# EAGLE design 16n (EAGLE 7.6.0)
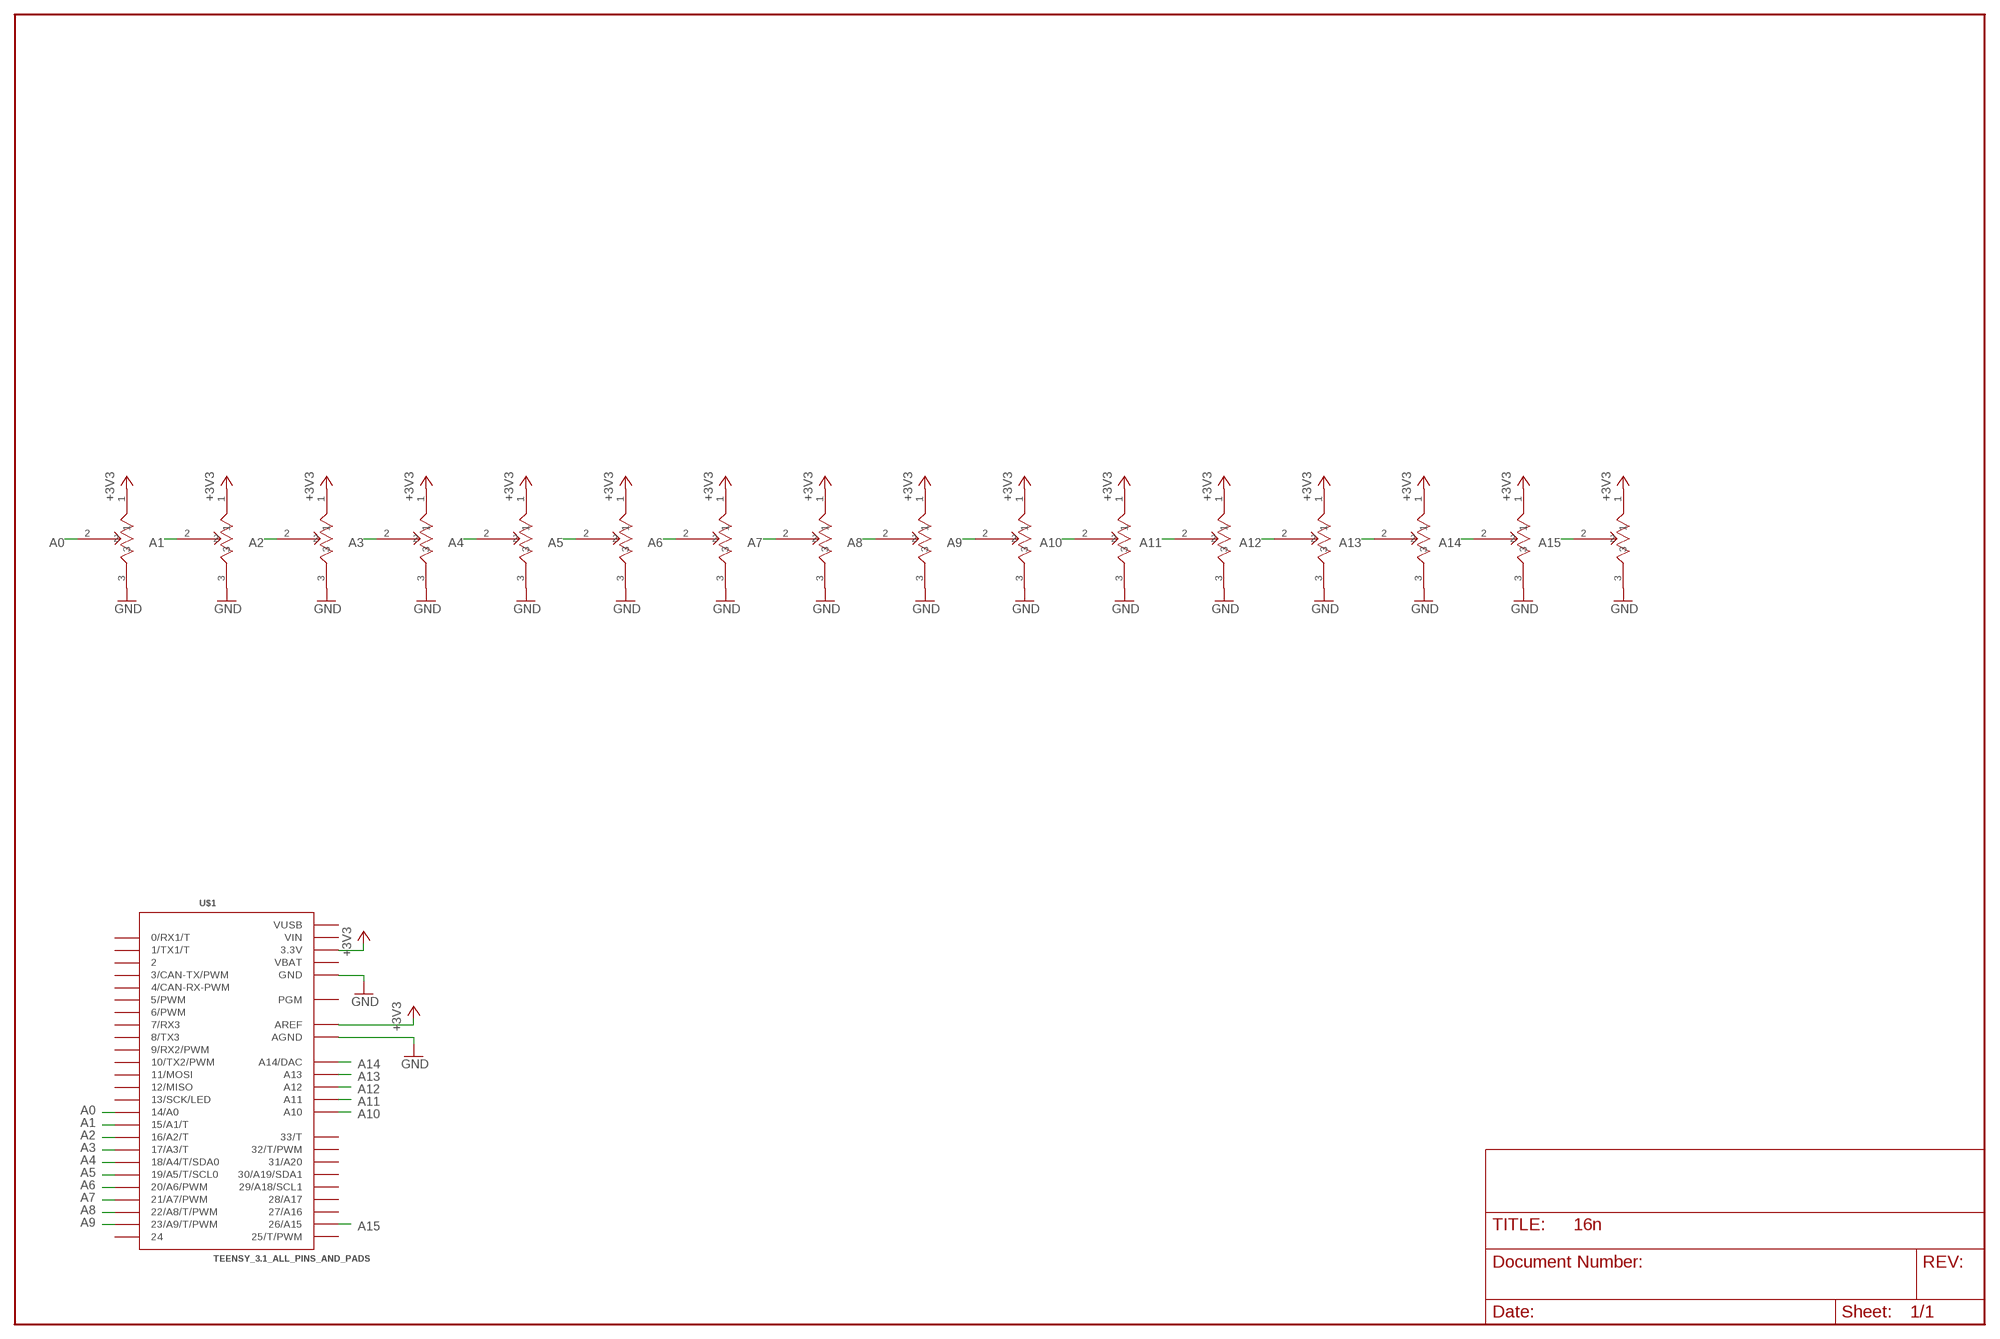
[diagram p0: schematic, sheet 1]

## Parts
U$1  TEENSY_3.1_ALL_PINS_AND_PADS  [TEENSY_3.1_ALLPINS]
U$2  SLIDEPOT-ALPS-60MM  [RS6011SP600]
U$3  SLIDEPOT-ALPS-60MM  [RS6011SP600]
U$4  SLIDEPOT-ALPS-60MM  [RS6011SP600]
U$5  SLIDEPOT-ALPS-60MM  [RS6011SP600]
U$6  SLIDEPOT-ALPS-60MM  [RS6011SP600]
U$7  SLIDEPOT-ALPS-60MM  [RS6011SP600]
U$8  SLIDEPOT-ALPS-60MM  [RS6011SP600]
U$9  SLIDEPOT-ALPS-60MM  [RS6011SP600]
U$10  SLIDEPOT-ALPS-60MM  [RS6011SP600]
U$11  SLIDEPOT-ALPS-60MM  [RS6011SP600]
U$12  SLIDEPOT-ALPS-60MM  [RS6011SP600]
U$13  SLIDEPOT-ALPS-60MM  [RS6011SP600]
U$14  SLIDEPOT-ALPS-60MM  [RS6011SP600]
U$15  SLIDEPOT-ALPS-60MM  [RS6011SP600]
U$16  SLIDEPOT-ALPS-60MM  [RS6011SP600]
U$17  SLIDEPOT-ALPS-60MM  [RS6011SP600]

## Nets
+3V3: U$1.3.3V U$1.3.3V1(3.3V) U$1.3.3V2(3.3V) U$1.AREF U$2.1 U$3.1 U$4.1 U$5.1 U$6.1 U$7.1 U$8.1 U$9.1 U$10.1 U$11.1 U$12.1 U$13.1 U$14.1 U$15.1 U$16.1 U$17.1
A0: U$1.14/A0 U$2.2
A1: U$1.15/A1(15/A1/T) U$3.2
A2: U$1.16/A2(16/A2/T) U$4.2
A3: U$1.17/A3(17/A3/T) U$5.2
A4: U$1.18/A4(18/A4/T/SDA0) U$6.2
A5: U$1.19/A5(19/A5/T/SCL0) U$7.2
A6: U$1.20/A6(20/A6/PWM) U$8.2
A7: U$1.21/A7(21/A7/PWM) U$9.2
A8: U$1.22/A8(22/A8/T/PWM) U$10.2
A9: U$1.23/A9(23/A9/T/PWM) U$11.2
A10: U$1.A10 U$12.2
A11: U$1.A11 U$13.2
A12: U$1.A12 U$14.2
A13: U$1.A13 U$15.2
A14: U$1.A14(A14/DAC) U$16.2
A15: U$1.26(26/A15) U$17.2
GND: U$1.AGND U$1.GND U$1.GND1(GND) U$1.GND2(GND) U$2.3 U$3.3 U$4.3 U$5.3 U$6.3 U$7.3 U$8.3 U$9.3 U$10.3 U$11.3 U$12.3 U$13.3 U$14.3 U$15.3 U$16.3 U$17.3
Unconnected: U$1.0(0/RX1/T) U$1.1(1/TX1/T) U$1.2 U$1.3(3/CAN-TX/PWM) U$1.4(4/CAN-RX-PWM) U$1.5(5/PWM) U$1.6(6/PWM) U$1.7(7/RX3) U$1.8(8/TX3) U$1.9(9/RX2/PWM) U$1.10(10/TX2/PWM) U$1.11(11/MOSI) U$1.12(12/MISO) U$1.13(13/SCK/LED) U$1.24 U$1.25(25/T/PWM) U$1.27(27/A16) U$1.28(28/A17) U$1.29(29/A18/SCL1) U$1.30(30/A19/SDA1) U$1.31(31/A20) U$1.32(32/T/PWM) U$1.33(33/T) U$1.PGM

## Power pins joined to a net without a drawn wire
VBAT: U$1.VBAT
VIN: U$1.VIN
VUSB: U$1.VUSB

## Library data of the parts
U$1 = Teensy_3_Series_Board_v1.0:TEENSY_3.1_ALL_PINS_AND_PADS: Footprint for Teensy 3.1 board using all pads and all through-holes. Pads need a 2x7 0.1" SMD header.
U$2-U$17 = monome:SLIDEPOT-ALPS-60MM

## Board
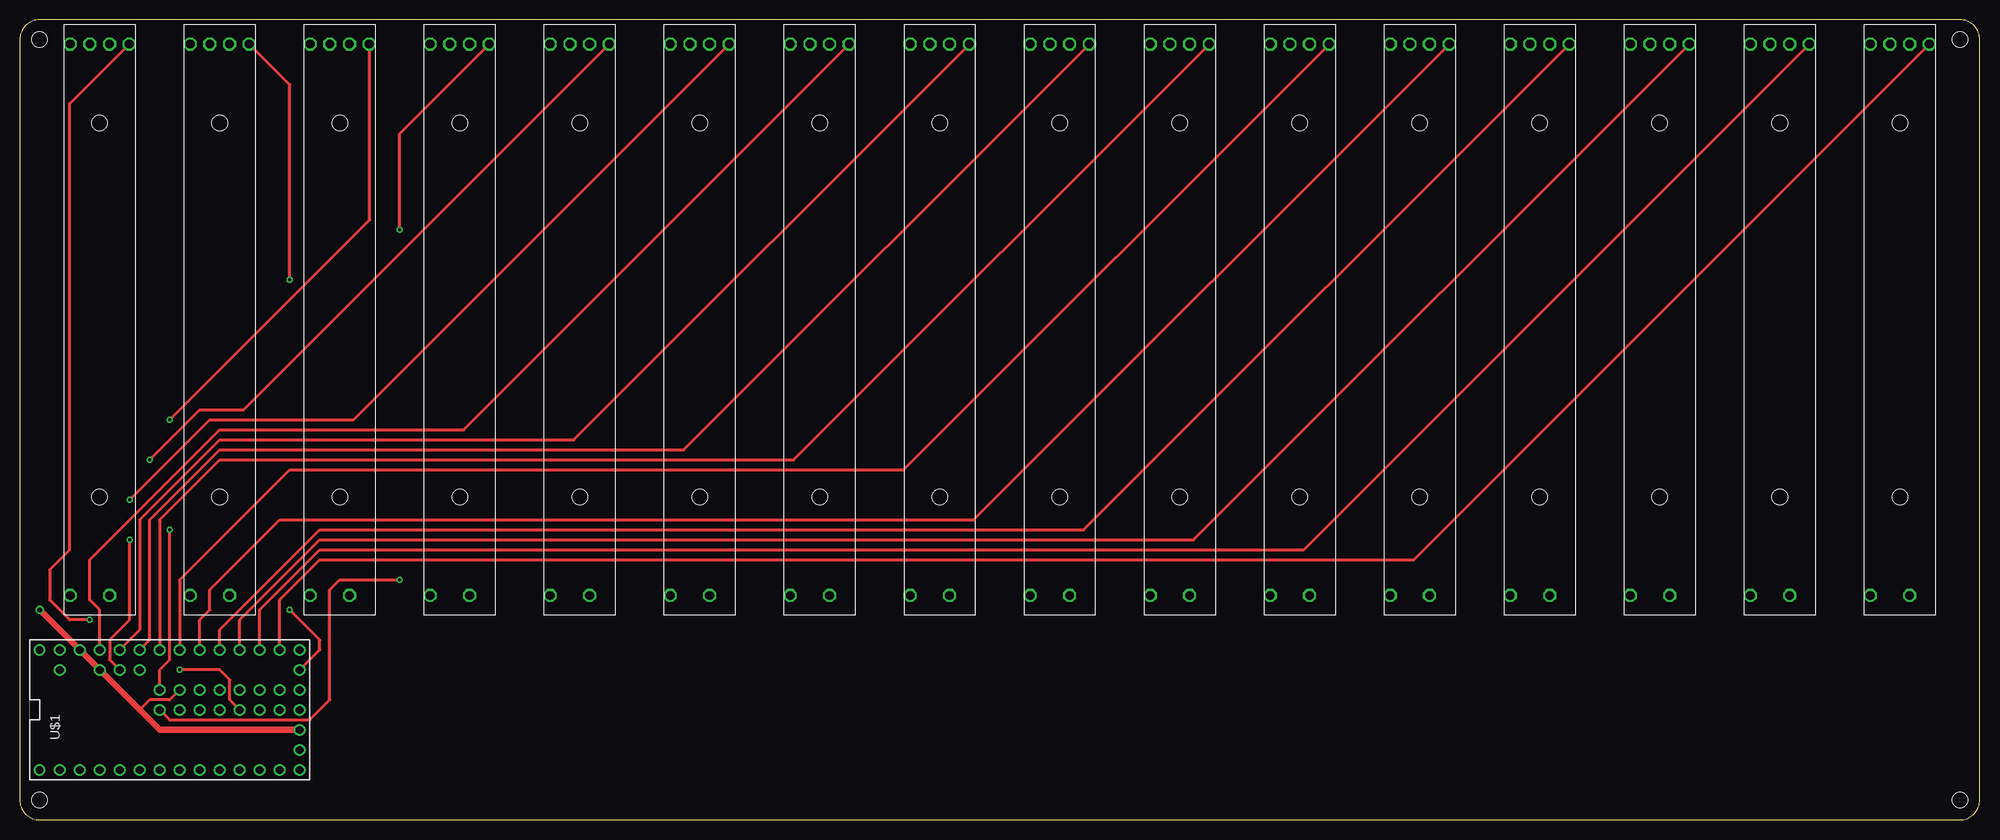
[diagram p1: board, top side]
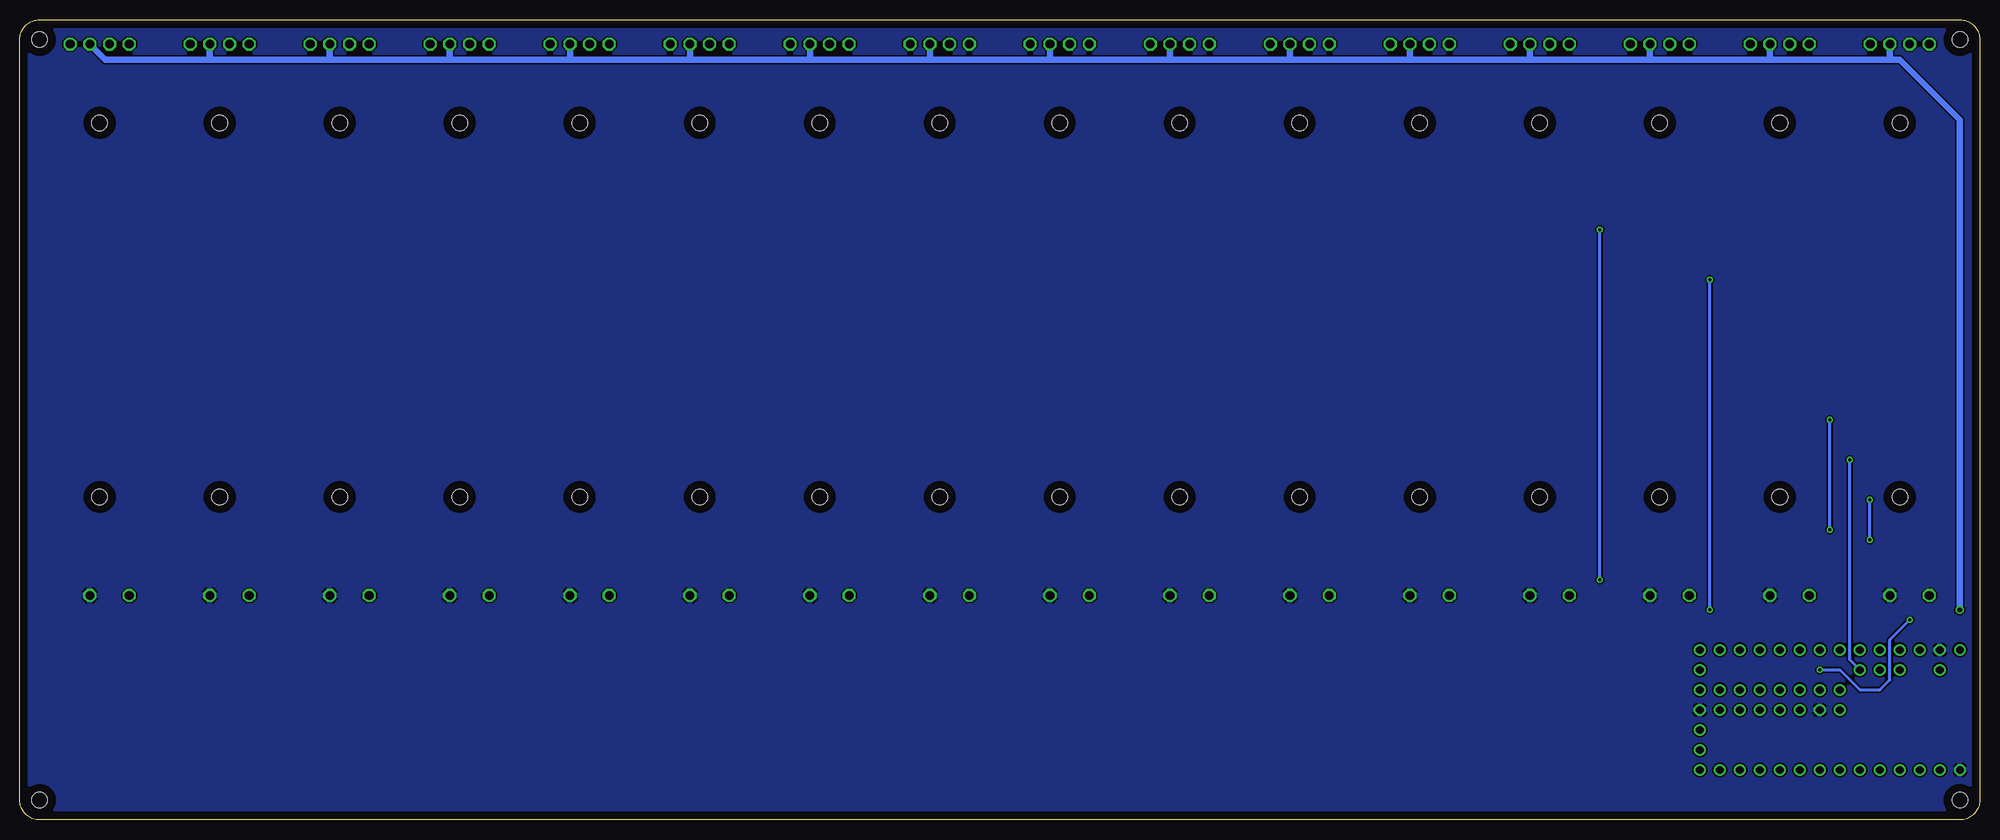
[diagram p2: board, bottom side, seen from below]

Size 248.92 x 101.6 mm. Coordinates in mm from the lower left corner, seen from the top.
Outline: 2.54,0 246.38,0 arc90 248.92,2.54 248.92,99.06 arc90 246.38,101.6 2.54,101.6 arc90 0,99.06 0,2.54 arc90 2.54,0
Copper layers (1*16): Top 0.035mm / dielectric 1.5mm / Bottom 0.035mm
Design rules "default": minimum track width 10mil, minimum drill 24mil, track to track 8mil, track to pad 8mil, pad to pad 8mil, via to via 8mil, smd to smd 8mil, copper to edge 40mil, drill to drill 8mil, minimum pad ring 10mil, minimum via ring 8mil, stop-mask expansion 4mil, vias tented up to drill 0mil, thermal gap 10mil
Holes 2 mm at 2.54,2.54 246.38,99.06 246.38,2.54 2.54,99.06

### Footprints (pad centres in the part's own frame; a part is rotated, then mirrored left to right if it is on the bottom)
TEENSY_3.1_ALLPINS = drill 0.965: 0 -7.62,15.24; 1 -7.62,12.7; 2 -7.62,10.16; 3 -7.62,7.62; 3.3V 7.62,12.7; 3.3V1 -2.54,-15.24; 3.3V2 2.54,0; 4 -7.62,5.08; 5 -7.62,2.54; 6 -7.62,0; 7 -7.62,-2.54; 8 -7.62,-5.08; 9 -7.62,-7.62; 10 -7.62,-10.16; 11 -7.62,-12.7; 12 -7.62,-15.24; 13 7.62,-15.24; 14/A0 7.62,-12.7; 15/A1 7.62,-10.16; 16/A2 7.62,-7.62; 17/A3 7.62,-5.08; 18/A4 7.62,-2.54; 19/A5 7.62,0; 20/A6 7.62,2.54; 21/A7 7.62,5.08; 22/A8 7.62,7.62; 23/A9 7.62,10.16; 24 0,-2.54; 25 0,-5.08; 26 0,-7.62; 27 0,-10.16; 28 0,-12.7; 29 2.54,-12.7; 30 2.54,-10.16; 31 2.54,-7.62; 32 2.54,-5.08; 33 2.54,-2.54; A10 5.08,7.62; A11 5.08,5.08; A12 0,2.54; A13 2.54,2.54; A14 5.08,-15.24; AGND 7.62,15.24; AREF 5.08,10.16; GND -7.62,17.78; GND1 0,-15.24; GND2 0,0; PGM 2.54,-15.24; VBAT -5.08,-15.24; VIN 7.62,17.78; VUSB 5.08,15.24
RS6011SP600 = drill 1.1 octagon: 1 -35,1.25; 2 -35,3.75; 3 35,1.25; L1 35,-3.75; L2 -35,-3.75; L3 -35,-1.25 | hole 2: -25,0; 22.5,0

### Placement (x,y rotation side)
U$1  20.32,13.97 90 top
U$2  238.76,63.5 270 top
U$3  223.52,63.5 270 top
U$4  208.28,63.5 270 top
U$5  193.04,63.5 270 top
U$6  177.8,63.5 270 top
U$7  162.56,63.5 270 top
U$8  147.32,63.5 270 top
U$9  132.08,63.5 270 top
U$10  116.84,63.5 270 top
U$11  101.6,63.5 270 top
U$12  86.36,63.5 270 top
U$13  71.12,63.5 270 top
U$14  55.88,63.5 270 top
U$15  40.64,63.5 270 top
U$16  25.4,63.5 270 top
U$17  10.16,63.5 270 top

### Tracks (layer width: path | path; a pad name or v marks a point on that pad's centre or on a via)
+3V3  (via drill 0.6)
  Top 0.406: U$1.3.3V2 19.05,15.24 16.51,15.24 15.24,13.97
  Top 0.813: v2.54,26.67 U$1.3.3V U$1.AREF 15.24,13.97 17.78,11.43 U$1.3.3V1
  Bottom 0.813: v2.54,26.67 2.54,88.9 10.16,96.52 11.43,96.52 | 11.43,96.52 26.67,96.52 | 26.67,96.52 41.91,96.52 | 41.91,96.52 57.15,96.52 | 57.15,96.52 72.39,96.52 | 72.39,96.52 87.63,96.52 | 87.63,96.52 102.87,96.52 | 102.87,96.52 118.11,96.52 | 118.11,96.52 133.35,96.52 | 133.35,96.52 148.59,96.52 | 148.59,96.52 163.83,96.52 | 163.83,96.52 179.07,96.52 | 179.07,96.52 194.31,96.52 | 194.31,96.52 209.55,96.52 | 209.55,96.52 224.79,96.52 | 224.79,96.52 238.03,96.52 U$2.1 | U$3.1 224.77,96.54 224.79,96.52 | U$4.1 209.53,96.54 209.55,96.52 | U$5.1 194.29,96.54 194.31,96.52 | U$6.1 179.05,96.54 179.07,96.52 | U$7.1 163.81,96.54 163.83,96.52 | U$8.1 148.57,96.54 148.59,96.52 | U$9.1 133.33,96.54 133.35,96.52 | U$10.1 118.09,96.54 118.11,96.52 | U$11.1 102.85,96.54 102.87,96.52 | U$12.1 87.61,96.54 87.63,96.52 | U$13.1 72.37,96.54 72.39,96.52 | U$14.1 57.13,96.54 57.15,96.52 | U$15.1 41.89,96.54 41.91,96.52 | U$16.1 26.65,96.54 26.67,96.52 | U$17.1 11.41,96.54 11.43,96.52
A0
  Top 0.406: U$2.2 177.03,33.02 38.1,33.02 33.02,27.94 U$1.14/A0
A1
  Top 0.406: U$3.2 163.06,34.29 38.1,34.29 30.48,26.67 U$1.15/A1
A2
  Top 0.406: U$4.2 149.09,35.56 38.1,35.56 27.94,25.4 U$1.16/A2
A3
  Top 0.406: U$5.2 135.12,36.83 38.1,36.83 25.4,24.13 U$1.17/A3
A4
  Top 0.406: U$6.2 121.15,38.1 33.02,38.1 24.13,29.21 24.13,26.67 22.86,25.4 U$1.18/A4
A5
  Top 0.406: U$7.2 112.26,44.45 34.29,44.45 20.32,30.48 U$1.19/A5
A6
  Top 0.406: U$8.2 98.29,45.72 25.4,45.72 17.78,38.1 U$1.20/A6
A7
  Top 0.406: U$9.2 84.32,46.99 25.4,46.99 16.51,38.1 16.51,22.86 U$1.21/A7
A8
  Top 0.406: U$10.2 70.35,48.26 25.4,48.26 15.24,38.1 15.24,24.13 U$1.22/A8
A9
  Top 0.406: U$11.2 56.38,49.53 25.4,49.53 8.89,33.02 8.89,27.94 10.16,26.67 U$1.23/A9
A10  (via drill 0.38)
  Top 0.406: v13.97,40.64 24.13,50.8 42.41,50.8 U$12.2 | v13.97,35.56 13.97,25.4 11.43,22.86 11.43,20.32 U$1.A10
  Bottom 0.406: v13.97,35.56 v13.97,40.64
A11  (via drill 0.38)
  Top 0.406: v16.51,45.72 22.86,52.07 28.44,52.07 U$13.2
  Bottom 0.406: U$1.A11 16.51,20.32 v16.51,45.72
A12  (via drill 0.38)
  Top 0.406: v48.26,30.48 40.64,30.48 39.37,29.21 39.37,15.24 36.83,12.7 19.05,12.7 U$1.A12 | v48.26,74.93 48.26,87.13 U$14.2
  Bottom 0.406: v48.26,30.48 v48.26,74.93
A13  (via drill 0.38)
  Top 0.406: v19.05,50.8 44.45,76.2 44.45,98.44 U$15.2 | U$1.A13 17.78,19.05 19.05,20.32 v19.05,36.83
  Bottom 0.406: v19.05,36.83 v19.05,50.8
A14  (via drill 0.38)
  Top 0.406: v34.29,68.58 34.29,93.36 U$16.2 | U$1.A14 38.1,21.59 38.1,22.86 v34.29,26.67
  Bottom 0.406: v34.29,26.67 v34.29,68.58
A15  (via drill 0.38)
  Top 0.406: U$17.2 6.35,90.94 6.35,34.29 3.81,31.75 3.81,27.94 6.35,25.4 v8.89,25.4 | U$1.26 26.67,15.24 26.67,17.78 25.4,19.05 v20.32,19.05
  Bottom 0.406: v20.32,19.05 17.78,19.05 15.24,16.51 12.7,16.51 11.43,17.78 11.43,22.86 v8.89,25.4
GND
  pour Bottom: 0,0 248.92,0 248.92,101.6 0,101.6